# Altium project AD9361_EXT.PrjPcb
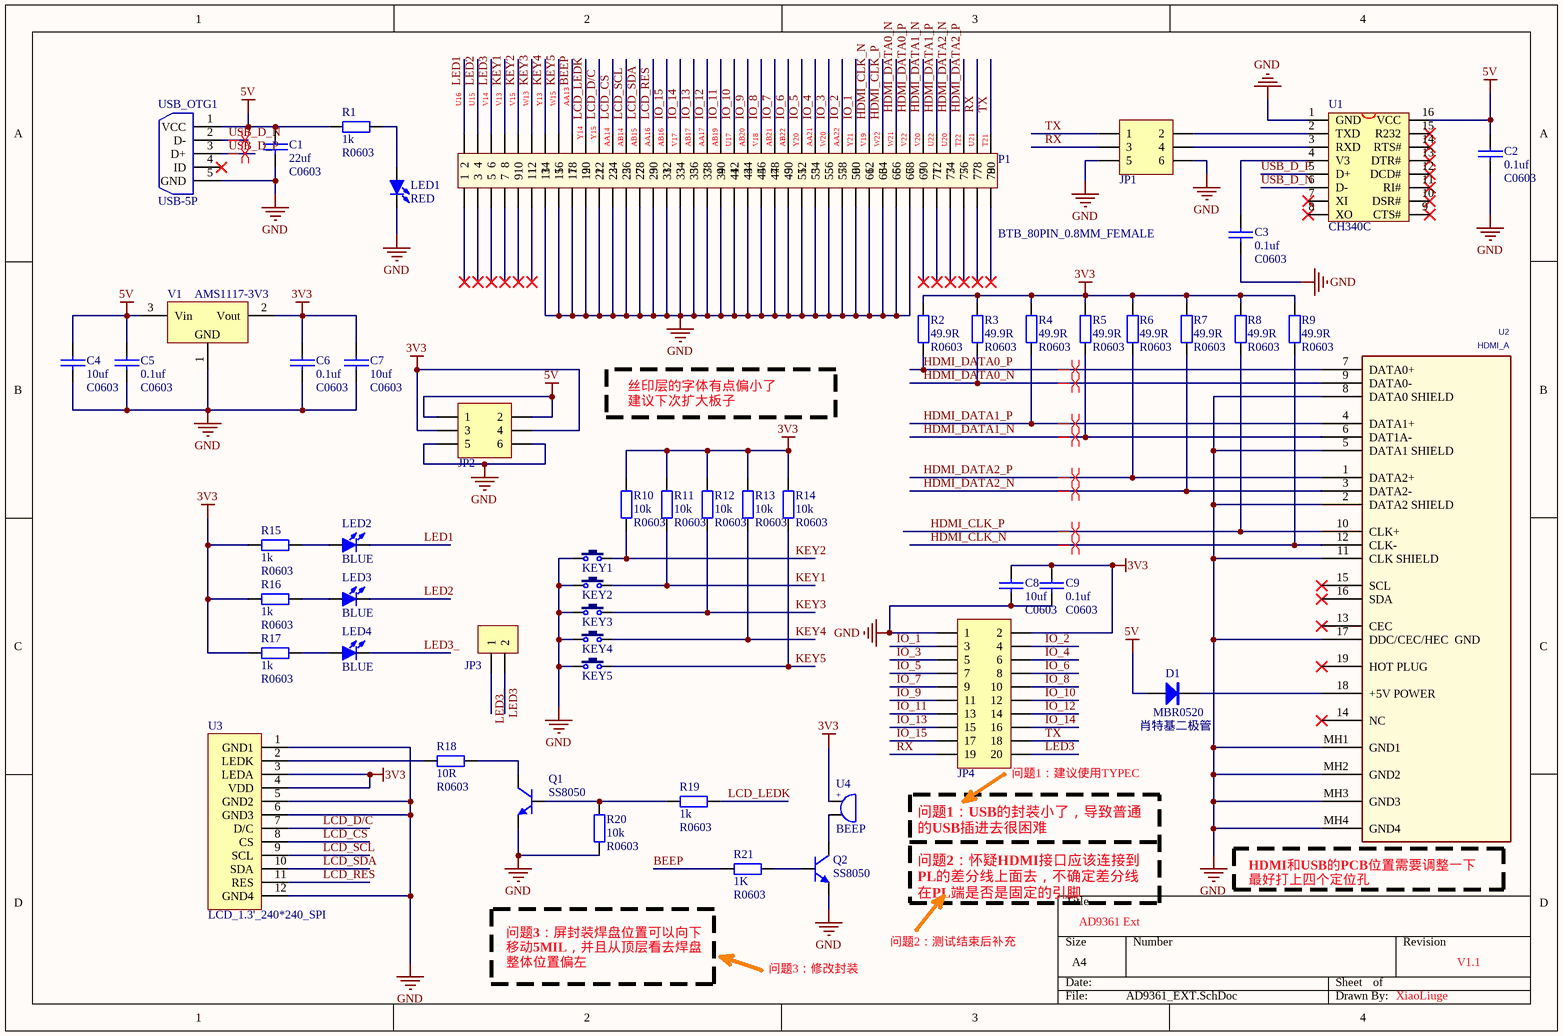
[diagram p0: AD9361_EXT.SchDoc]
1 sheet, 53 parts. Net scope: global (net labels, ports and power ports of the same name join across sheets).
Board file: AD9361_EXT.PcbDoc

## Sheet AD9361_EXT.SchDoc: AD9361 Ext
size A4; Date: 2021/11/13; DrawnBy: XiaoLiuge; Revision: V1.1; SheetNumber: 1; SheetTotal: 1

### Parts
C1  22uf  FOOTPRINT: C0603  [C 0603_L]
C2  0.1uf  FOOTPRINT: C0603  [C 0603_L]
C3  0.1uf  FOOTPRINT: C0603  [C 0603_L]
C4  10uf  FOOTPRINT: C0603  [C 0603_L]
C5  0.1uf  FOOTPRINT: C0603  [C 0603_L]
C6  0.1uf  FOOTPRINT: C0603  [C 0603_L]
C7  10uf  FOOTPRINT: C0603  [C 0603_L]
C8  10uf  FOOTPRINT: C0603  [C 0603_L]
C9  0.1uf  FOOTPRINT: C0603  [C 0603_L]
D1  MBR0520  [SOD-323]
JP1  Header3X2  [HDR2.54-LI-2x3P]  (value not drawn)
JP2  Header3X2  [HDR2.54-LI-2x3P]  (value not drawn)
JP3  HDR-1X2  [HDR2.54-LI-2P]  (value not drawn)
JP4  Header 2X10  [HDR2.54-LI-2x10P]  (value not drawn)
KEY1  KEY  [TSW SMD-6*6*6]  (value not drawn)
KEY2  KEY  [TSW SMD-6*6*6]  (value not drawn)
KEY3  KEY  [TSW SMD-6*6*6]  (value not drawn)
KEY4  KEY  [TSW SMD-6*6*6]  (value not drawn)
KEY5  KEY  [TSW SMD-6*6*6]  (value not drawn)
LED1  RED  [LED 0603R]
LED2  BLUE  [LED 0603B]
LED3  BLUE  [LED 0603B]
LED4  BLUE  [LED 0603B]
P1  BTB_80PIN_0.8MM_FEMALE  [BTB_BOTTOM_80PIN_1.27MM]
Q1  SS8050  [SOT23-3L]
Q2  SS8050  [SOT23-3L]
R1  1k  FOOTPRINT: R0603  [R 0603_L]
R2  49.9R  FOOTPRINT: R0603  [R 0603_L]
R3  49.9R  FOOTPRINT: R0603  [R 0603_L]
R4  49.9R  FOOTPRINT: R0603  [R 0603_L]
R5  49.9R  FOOTPRINT: R0603  [R 0603_L]
R6  49.9R  FOOTPRINT: R0603  [R 0603_L]
R7  49.9R  FOOTPRINT: R0603  [R 0603_L]
R8  49.9R  FOOTPRINT: R0603  [R 0603_L]
R9  49.9R  FOOTPRINT: R0603  [R 0603_L]
R10  10k  FOOTPRINT: R0603  [R 0603_L]
R11  10k  FOOTPRINT: R0603  [R 0603_L]
R12  10k  FOOTPRINT: R0603  [R 0603_L]
R13  10k  FOOTPRINT: R0603  [R 0603_L]
R14  10k  FOOTPRINT: R0603  [R 0603_L]
R15  1k  FOOTPRINT: R0603  [R 0603_L]
R16  1k  FOOTPRINT: R0603  [R 0603_L]
R17  1k  FOOTPRINT: R0603  [R 0603_L]
R18  10R  FOOTPRINT: R0603  [R 0603_L]
R19  1k  FOOTPRINT: R0603  [R 0603_L]
R20  10k  FOOTPRINT: R0603  [R 0603_L]
R21  1K  FOOTPRINT: R0603  [R 0603_L]
U1  CH340C  [SOP16_N]
U2  HDMI_A  [HDMI]
U3  LCD_1.3'_240*240_SPI  [TFT_1.3'_SPI_RGB_240*240]
U4  BEEP  [BEEP 5x9x5.5]
USB_OTG1  USB-5P  [USB-MICRO_A]
V1  AMS1117-3V3  [SOT223_L]

### Nets
3V3: C6.1 C7.1 C8.1 C9.1 JP2.3 JP2.4 JP4.2 R2.2 R3.2 R4.2 R5.2 R6.2 R7.2 R8.2 R9.2 R10.2 R11.2 R12.2 R13.2 R14.2 R15.1 R16.1 R17.1 U3.3(LEDA) U3.4(VDD) U4.1 V1.2(Vout)
5V: C1.1 C2.1 C4.1 C5.1 D1.1(A) JP2.1 JP2.2 R1.1 U1.16(VCC) USB_OTG1.1(VCC) V1.3(Vin)
GND: C1.2 C2.2 C3.2 C4.2 C5.2 C6.2 C7.2 C8.2 C9.2 JP1.5 JP1.6 JP2.5 JP2.6 JP4.1 KEY1.1 KEY2.1 KEY3.1 KEY4.1 KEY5.1 LED1.2(K) P1.13 P1.15 P1.17 P1.19 P1.21 P1.23 P1.25 P1.27 P1.29 P1.31 P1.33 P1.35 P1.37 P1.39 P1.41 P1.43 P1.45 P1.47 P1.49 P1.51 P1.53 P1.55 P1.57 P1.59 P1.61 P1.63 P1.65 P1.67 Q1.2(E) Q2.2(E) R20.1 U1.1(GND) U2.2(DATA2_SHIELD) U2.5(DATA1_SHIELD) U2.8(DATA0_SHIELD) U2.11(CLK_SHIELD) U2.17(DDC/CEC/HEC__GND) U2.MH1(GND1) U2.MH2(GND2) U2.MH3(GND3) U2.MH4(GND4) U3.1(GND1) U3.5(GND2) U3.6(GND3) U3.12(GND4) USB_OTG1.5(GND) V1.1(GND)
BEEP: P1.18 R21.1
HDMI_CLK_N: P1.62 R9.1 U2.12(CLK-)
HDMI_CLK_P: P1.64 R8.1 U2.10(CLK+)
HDMI_DATA0_N: P1.66 R3.1 U2.9(DATA0-)
HDMI_DATA0_P: P1.68 R2.1 U2.7(DATA0+)
HDMI_DATA1_N: P1.70 R5.1 U2.6(DAT1A-)
HDMI_DATA1_P: P1.72 R4.1 U2.4(DATA1+)
HDMI_DATA2_N: P1.74 R7.1 U2.3(DATA2-)
HDMI_DATA2_P: P1.76 R6.1 U2.1(DATA2+)
IO_1: JP4.3 P1.60
IO_2: JP4.4 P1.58
IO_3: JP4.5 P1.56
IO_4: JP4.6 P1.54
IO_5: JP4.7 P1.52
IO_6: JP4.8 P1.50
IO_7: JP4.9 P1.48
IO_8: JP4.10 P1.46
IO_9: JP4.11 P1.44
IO_10: JP4.12 P1.42
IO_11: JP4.13 P1.40
IO_12: JP4.14 P1.38
IO_13: JP4.15 P1.36
IO_14: JP4.16 P1.34
IO_15: JP4.17 P1.32
KEY1: KEY2.2 P1.8 R11.1
KEY2: KEY1.2 P1.10 R10.1
KEY3: KEY3.2 P1.12 R12.1
KEY4: KEY4.2 P1.14 R13.1
KEY5: KEY5.2 P1.16 R14.1
LCD_CS: P1.24 U3.8(CS)
LCD_D/C: P1.22 U3.7(D/C)
LCD_LEDK: P1.20 R19.2
LCD_RES: P1.30 U3.11(RES)
LCD_SCL: P1.26 U3.9(SCL)
LCD_SDA: P1.28 U3.10(SDA)
LED1: LED2.2(K) P1.2
LED2: LED3.2(K) P1.4
LED3: JP3.2 JP4.20 P1.6
LED3_: JP3.1 LED4.2(K)
RX: JP1.3 JP4.19 P1.78
TX: JP1.1 JP4.18 P1.80
USB_D_N: U1.6(D-) USB_OTG1.2(D-)
USB_D_P: U1.5(D+) USB_OTG1.3(D+)
NetC3_1: C3.1 U1.4(V3)
NetD1_2: D1.2(K) U2.18(+5V_POWER)
NetJP1_2: JP1.2 U1.2(TXD)
NetJP1_4: JP1.4 U1.3(RXD)
NetLED1_1: LED1.1(A) R1.2
NetLED2_1: LED2.1(A) R15.2
NetLED3_1: LED3.1(A) R16.2
NetLED4_1: LED4.1(A) R17.2
NetQ1_1: Q1.1(B) R19.1 R20.2
NetQ1_3: Q1.3(C) R18.2
NetQ2_1: Q2.1(B) R21.2
NetQ2_3: Q2.3(C) U4.2
NetR18_1: R18.1 U3.2(LEDK)

Not connected (* = marked no-connect by the designer): P1 1* 3* 5* 7* 9* 11* 69* 71* 73* 75* 77* 79*; U1 7(XI)* 8(XO)* 9(CTS#)* 10(DSR#)* 11(RI#)* 12(DCD#)* 13(DTR#)* 14(RTS#)* 15(R232)*; U2 13(CEC)* 14(NC)* 15(SCL)* 16(SDA)* 19(HOT_PLUG)*; USB_OTG1 4(ID)*

### Layout directives
differential pair: HDMI_CLK_N, HDMI_CLK_P, HDMI_DATA0_N, HDMI_DATA0_P, HDMI_DATA1_N, HDMI_DATA1_P, HDMI_DATA2_N, HDMI_DATA2_P, USB_D_N, USB_D_P

### Notes on the sheet
- (near P1) U16
- (near P1) U15
- (near P1) V14
- (near P1) V13
- (near P1) V15
- (near P1) W13
- (near P1) Y13
- (near P1) W15
- (near P1) AA13
- (near P1) Y14
- (near P1) Y15
- (near P1) AA14
- (near P1) AB14
- (near P1) AB15
- (near P1) AA16
- (near P1) AB16
- (near P1) V17
- (near P1) AB17
- (near P1) AA17
- (near P1) AB19
- (near P1) U17
- (near P1) AB20
- (near P1) V18
- (near P1) AB21
- (near P1) AB22
- (near P1) Y20
- (near P1) AA21
- (near P1) W20
- (near P1) AA22
- (near P1) Y21
- (near P1) V19
- (near P1) W22
- (near P1) W21
- (near P1) V22
- (near P1) V20
- (near P1) U22
- (near P1) U20
- (near P1) T22
- (near P1) U21
- (near P1) T21
- 丝印层的字体有点偏小了
  建议下次扩大板子
- (near JP4) 问题1：建议使用TYPEC
- 问题1：USB的封装小了，导致普通的USB插进去很困难
  问题2：怀疑HDMI接口应该连接到PL的差分线上面去，不确定差分线在PL端是否是固定的引脚
- (near U2) HDMI和USB的PCB位置需要调整一下
  最好打上四个定位孔
- 问题3：修改封装
- 问题2：测试结束后补充
- 问题3：屏封装焊盘位置可以向下移动5MIL，并且从顶层看去焊盘整体位置偏左
- (in symbol BEEP) +

### Library data of the parts
C1-C9 = CAP_0603: 0603无极性贴片电容
D1 = SS14: 肖特基二极管; 版权归属: 源创客; 属性: 40V/1A; 学习资源: www.ooocke.com; BOM名称: 肖特基二极管
JP1 JP2 = Header 3X2: 3*2P接插件; 版权归属: 封装库来自淘宝 ID：黄晶宝石; BOM名称: 3*2P接插件; 学习资源: https://shop463601444.taobao.com
JP3 = Header 2: 2P接插件; 版权归属: 封装库来自淘宝 ID：黄晶宝石; BOM名称: 2P接插件; 联系售后: https://shop463601444.taobao.com
JP4 = Header 10X2: 10*2P接插件; 版权归属: 源创客; BOM名称: 10*2P接插件; 学习资源: www.ooocke.com
KEY1-KEY5 = KEY: 按键; BOM名称: 3x6轻触开关; 版权归属: 源创客; 学习资源: www.ooocke.com
LED1-LED4 = LED-SMD: 贴片LED; 版权归属: 源创客; BOM名称: 贴片LED; 学习资源: www.ooocke.com
P1 = BTB_80PIN_0.8MM_FEMALE: BTB接口0.8MM间距母头; PIN_DISTANCE: 0.8MM
Q1 Q2 = 8050-SMD: 高频放大-NPN型; 版权归属: 源创客; 属性: 40V 1.5A 1W 100MHZ; BOM名称: 高频放大-NPN型; 学习资源: www.ooocke.com
R1-R21 = RES_0603: 0603电阻
U1 = CH340C: USB2UART
U2 = HDMI_A: HDMI_A接口
U3 = LCD_1.3'_240*240_SPI: 1.3‘_SPI_中景圆屏幕
U4 = BEEP: 蜂鸣器; 版权归属: 源创客; BOM名称: 蜂鸣器; 学习资源: www.ooocke.com
USB_OTG1 = Micro_USB: 微型USB母座; 版权归属: 源创客; BOM名称: 微型USB母座; 学习资源: www.ooocke.com
V1 = AMS1117: 三端稳压芯片; BOM名称: 稳压芯片; 版权归属: 源创客; 学习资源: www.ooocke.com